# Altium schematic sheet 0200_GPP_MUX_G_H.SchDoc
size 848 x 558 mm
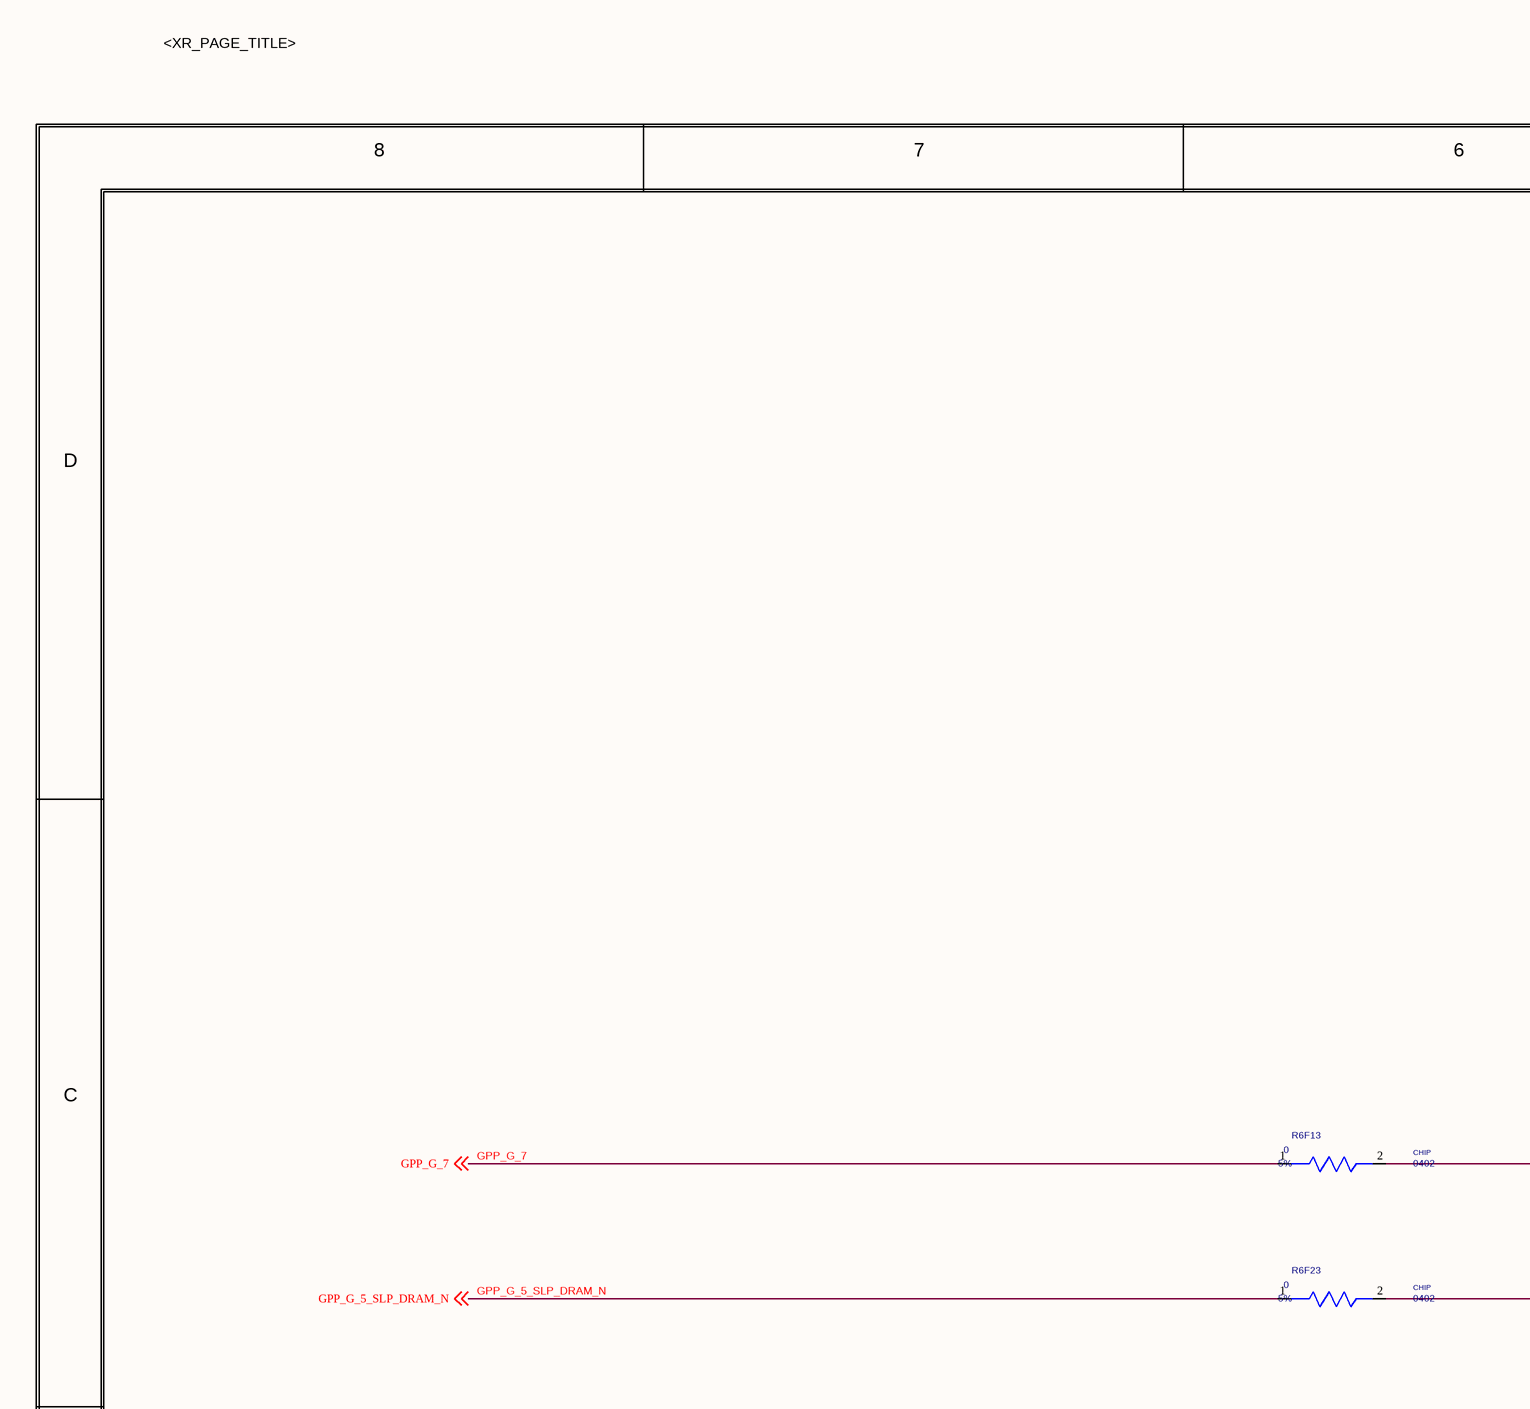
[diagram p0: 0200_GPP_MUX_G_H.SchDoc, top left]
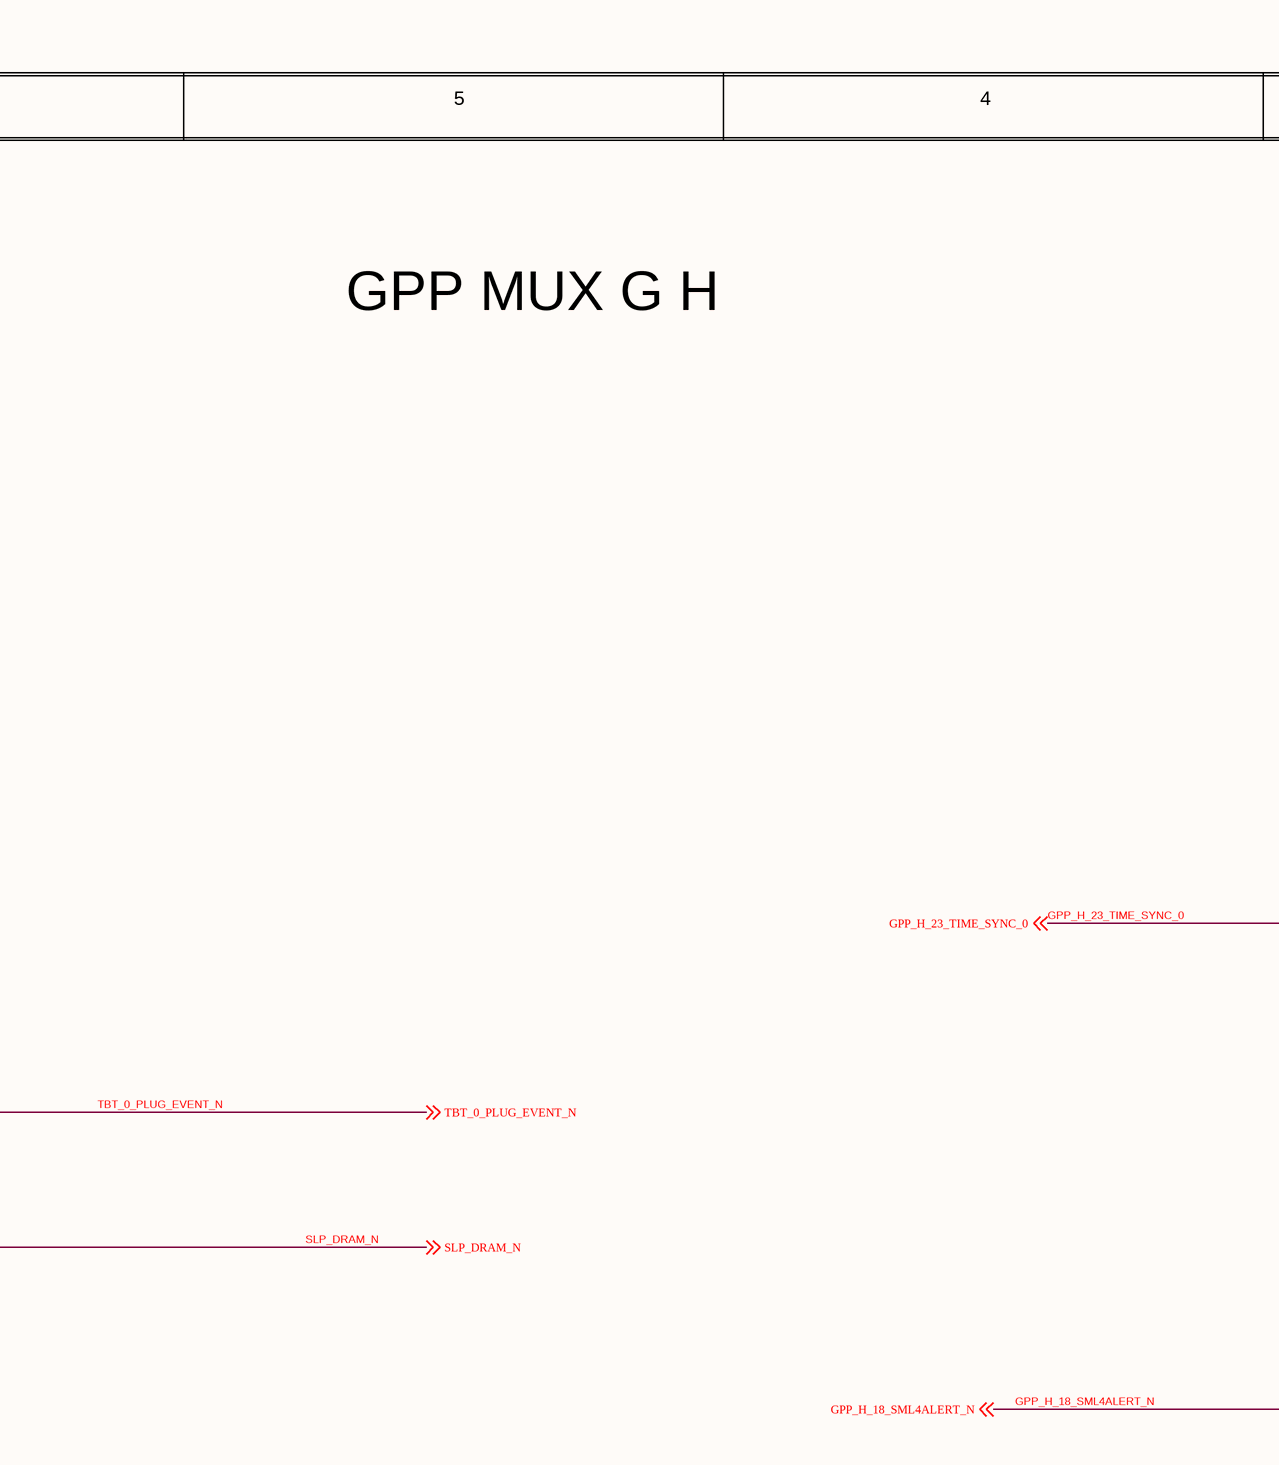
[diagram p1: 0200_GPP_MUX_G_H.SchDoc, top middle]
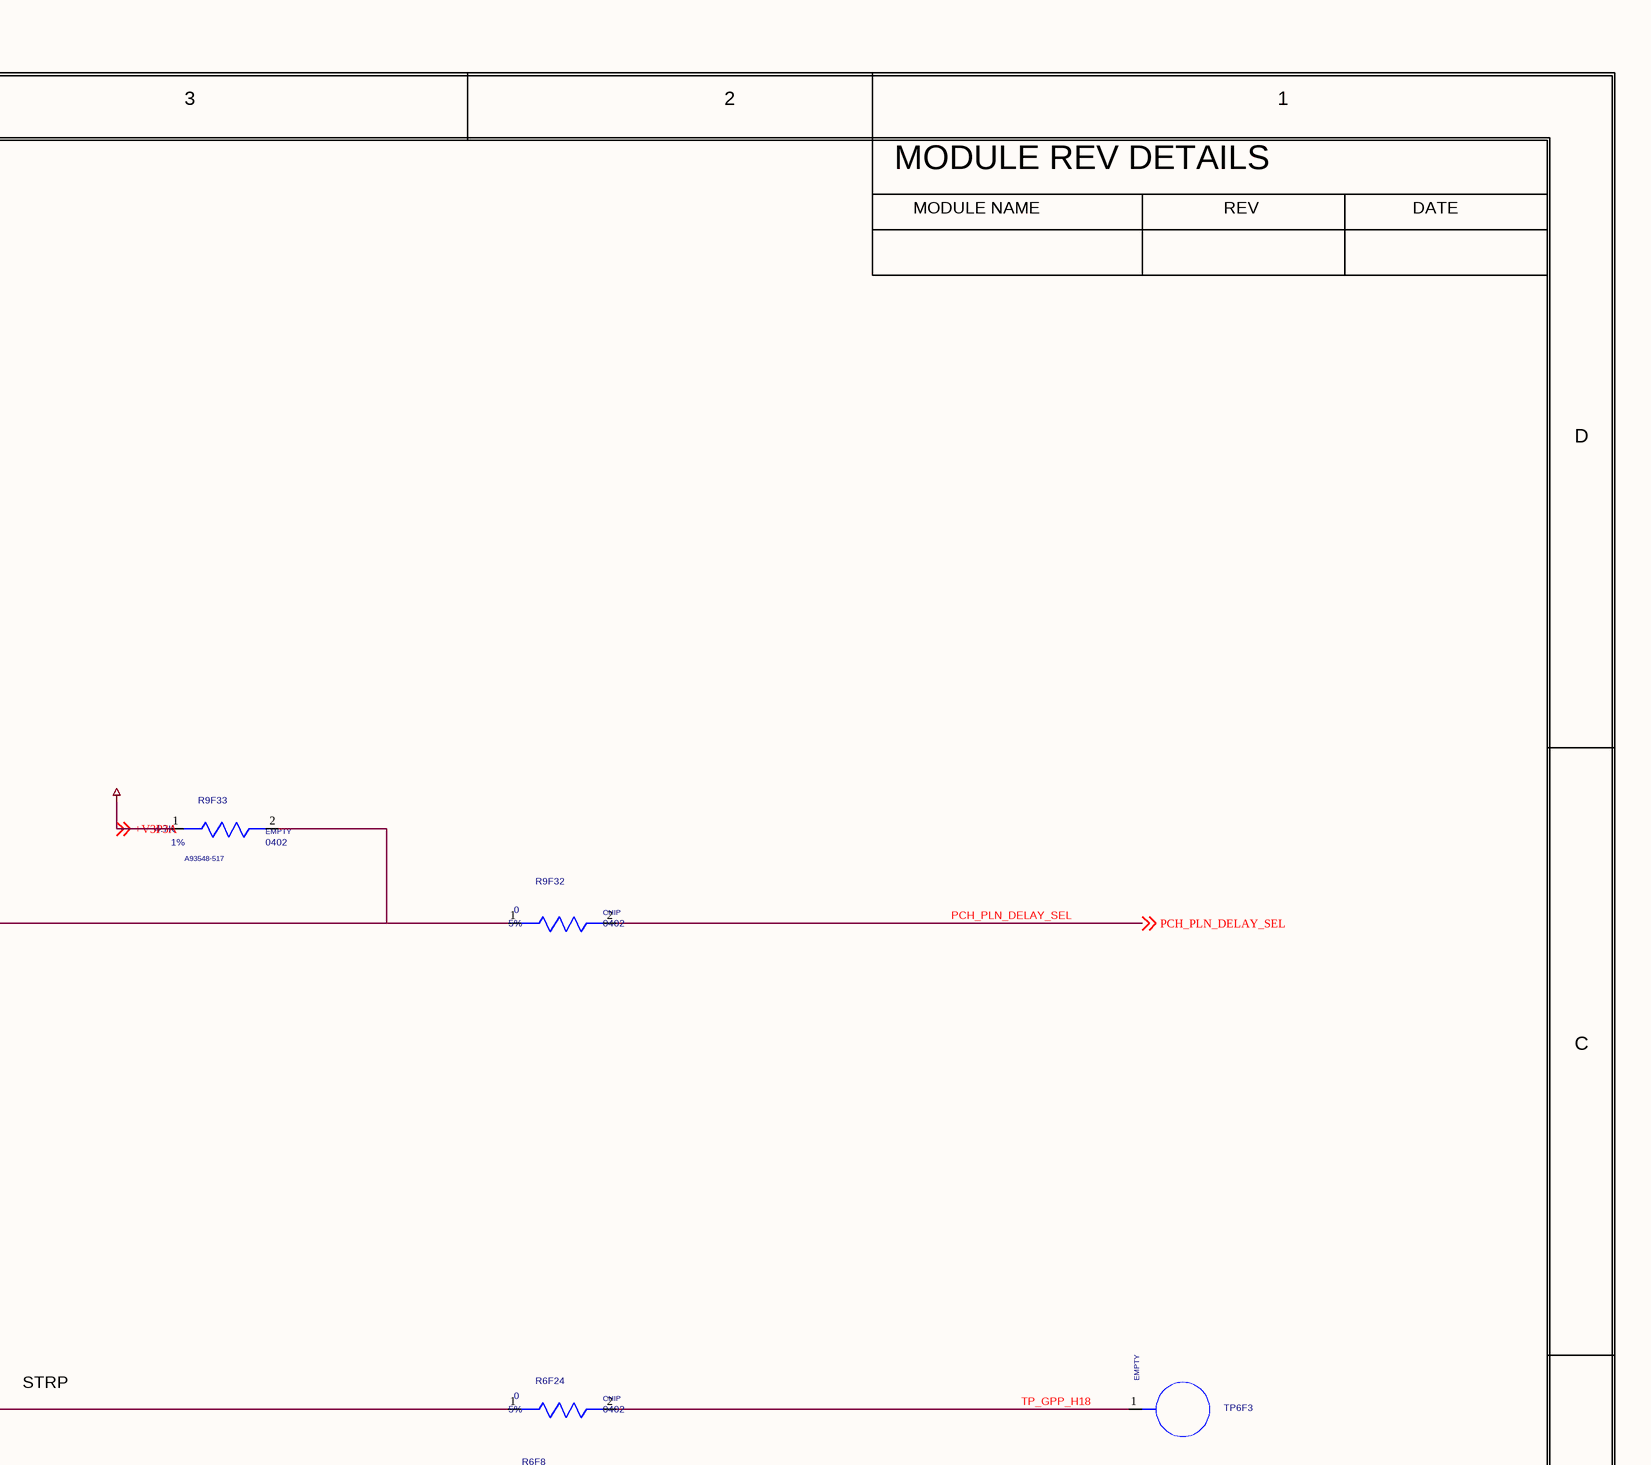
[diagram p2: 0200_GPP_MUX_G_H.SchDoc, top right]
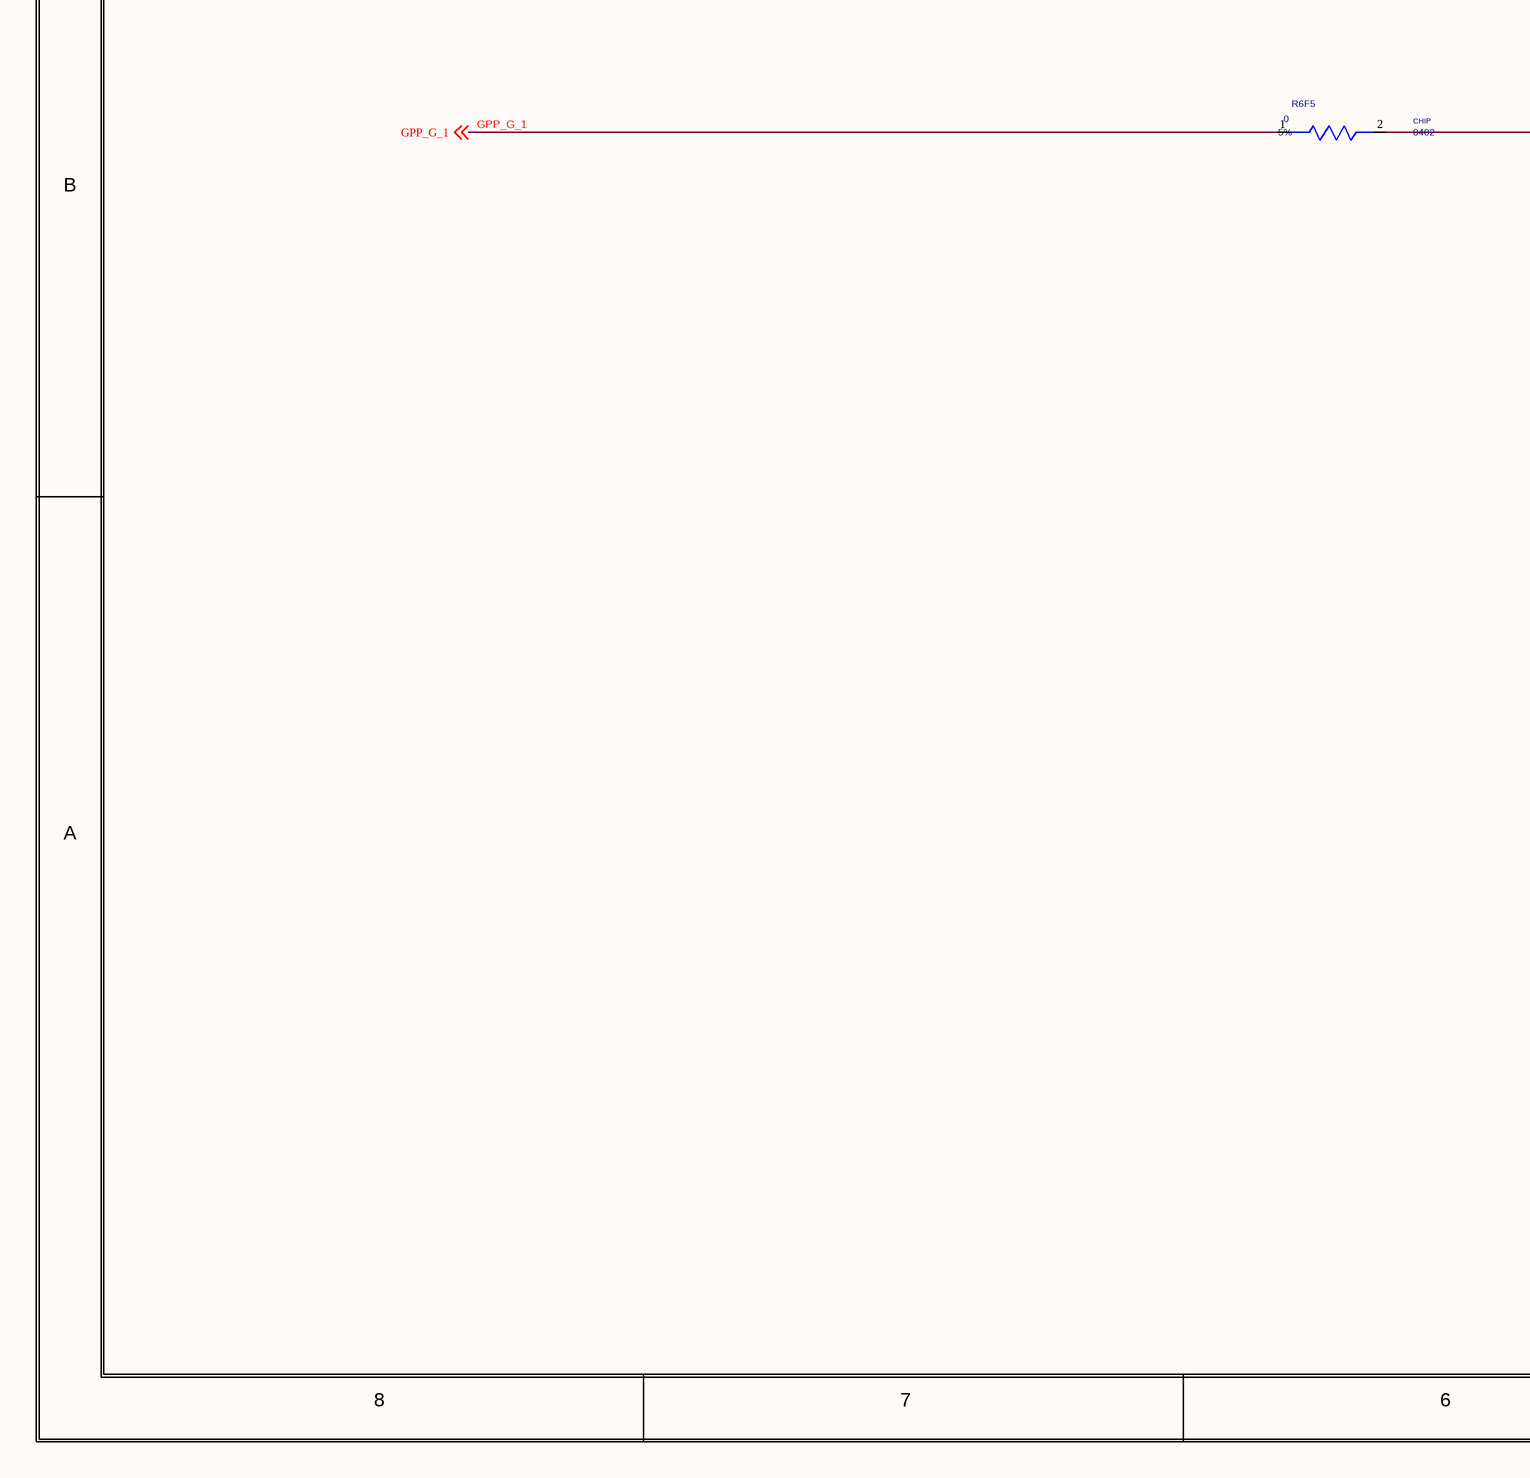
[diagram p3: 0200_GPP_MUX_G_H.SchDoc, bottom left]
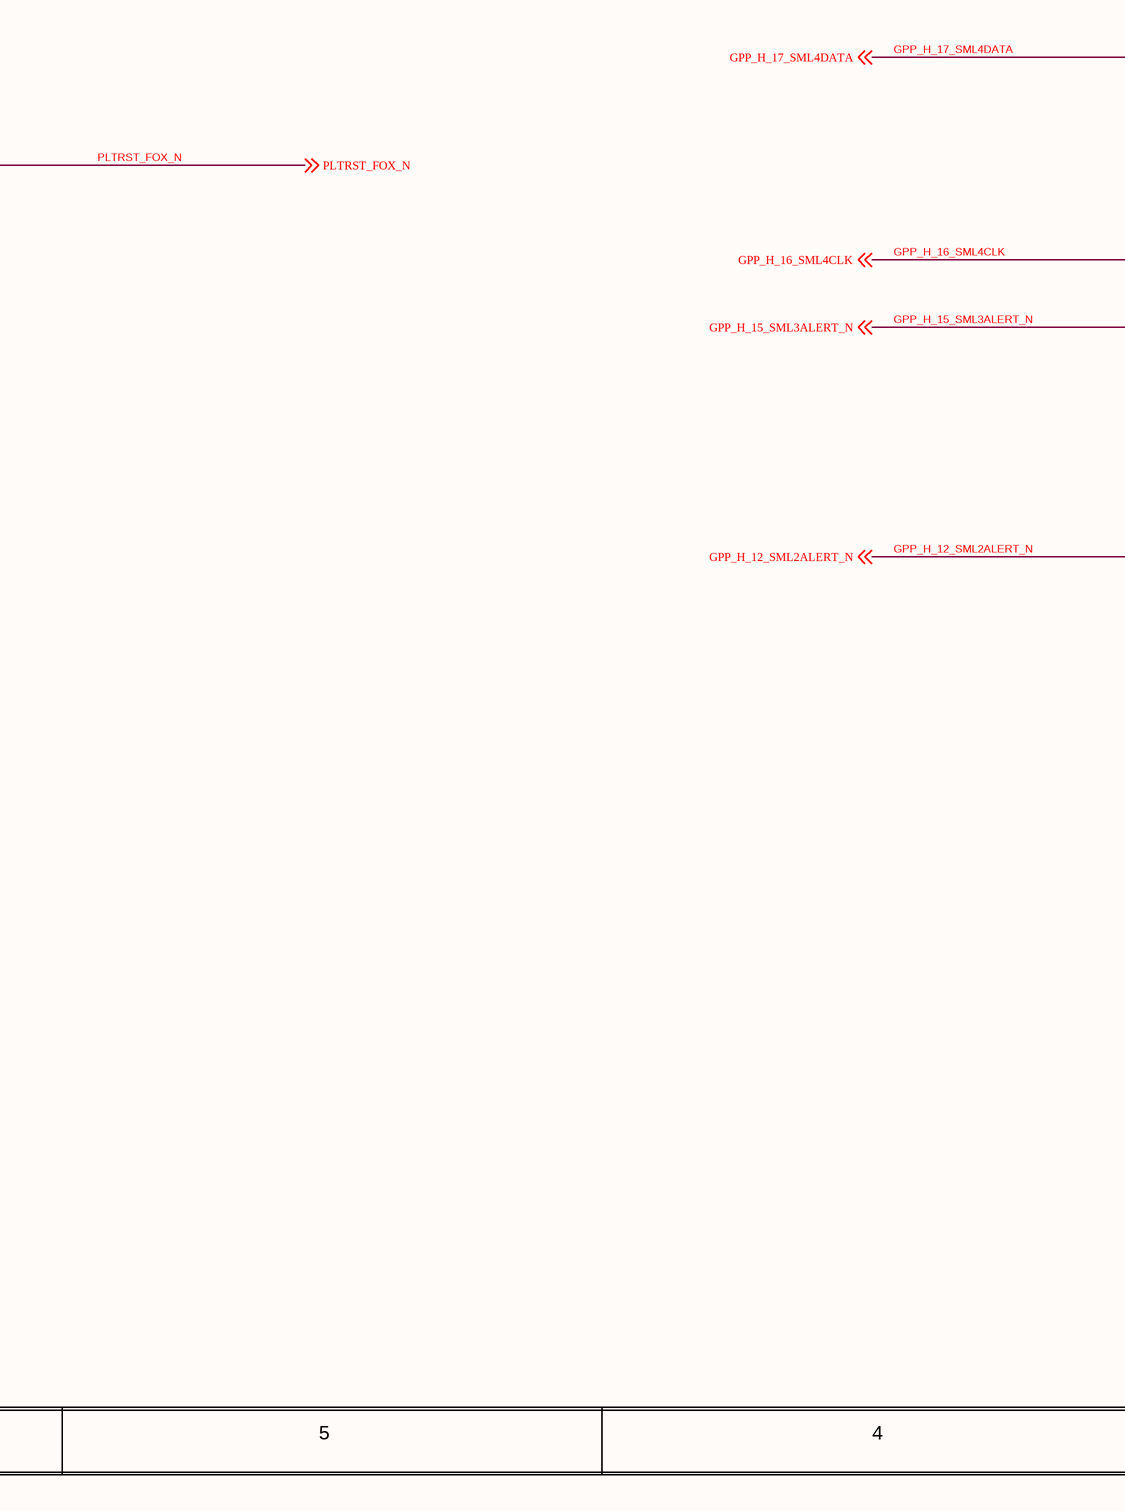
[diagram p4: 0200_GPP_MUX_G_H.SchDoc, bottom middle]
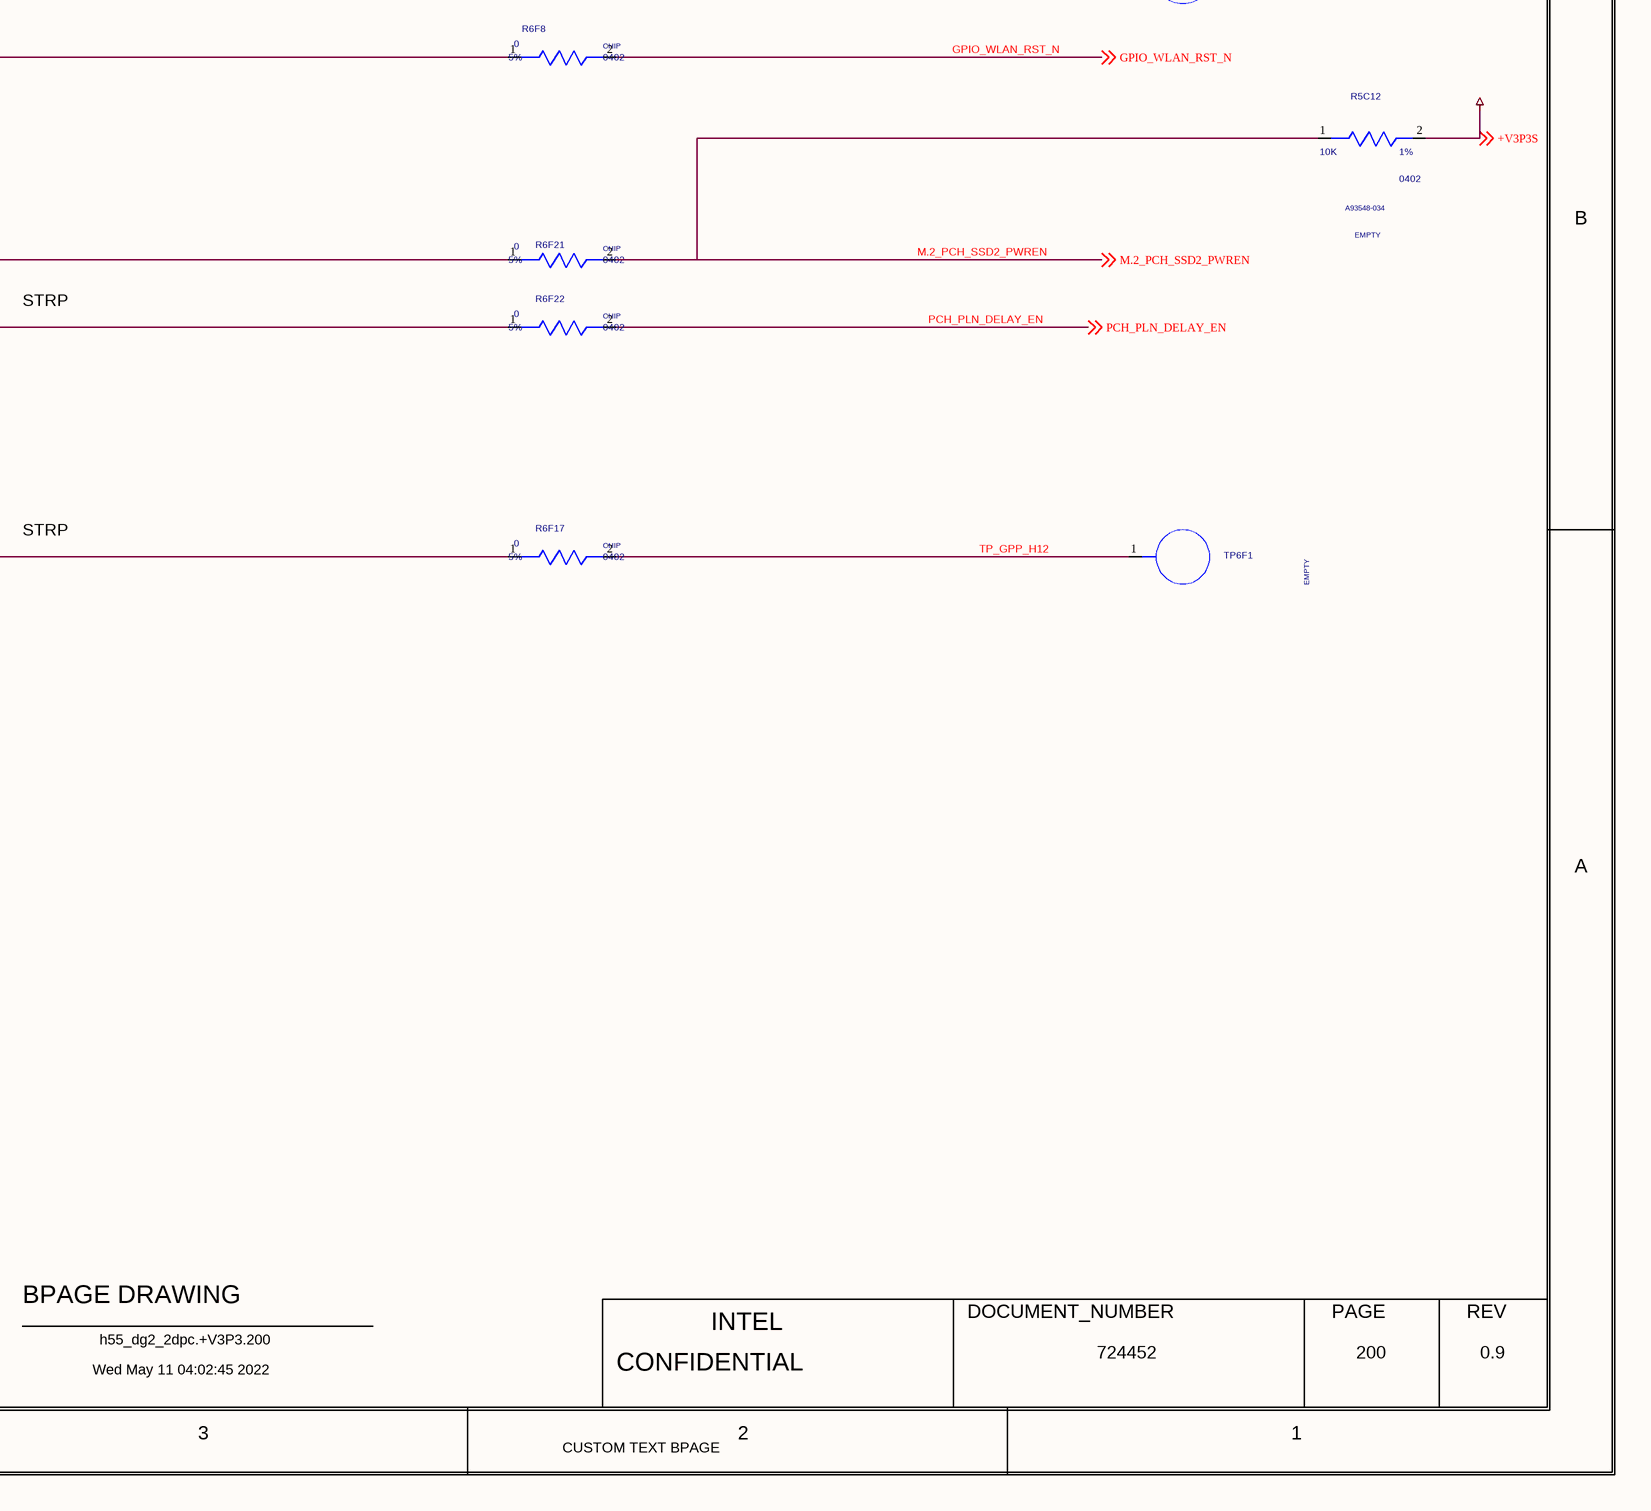
[diagram p5: 0200_GPP_MUX_G_H.SchDoc, bottom right]

## Parts
R5C12  10K  MATERIAL: EMPTY  PACK_TYPE: 0402  PART_NUMBER: A93548-034  TOLERANCE: 1%  [SMR0402IA]
R6F5  0  MATERIAL: CHIP  PACK_TYPE: 0402  TOLERANCE: 5%  [SMR0402IA]
R6F8  0  MATERIAL: CHIP  PACK_TYPE: 0402  TOLERANCE: 5%  [SMR0402IA]
R6F13  0  MATERIAL: CHIP  PACK_TYPE: 0402  TOLERANCE: 5%  [SMR0402IA]
R6F17  0  MATERIAL: CHIP  PACK_TYPE: 0402  TOLERANCE: 5%  [SMR0402IA]
R6F21  0  MATERIAL: CHIP  PACK_TYPE: 0402  TOLERANCE: 5%  [SMR0402IA]
R6F22  0  MATERIAL: CHIP  PACK_TYPE: 0402  TOLERANCE: 5%  [SMR0402IA]
R6F23  0  MATERIAL: CHIP  PACK_TYPE: 0402  TOLERANCE: 5%  [SMR0402IA]
R6F24  0  MATERIAL: CHIP  PACK_TYPE: 0402  TOLERANCE: 5%  [SMR0402IA]
R9F32  0  MATERIAL: CHIP  PACK_TYPE: 0402  TOLERANCE: 5%  [SMR0402IA]
R9F33  4.7K  MATERIAL: EMPTY  PACK_TYPE: 0402  PART_NUMBER: A93548-517  TOLERANCE: 1%  [SMR0402IA]
TP6F1  MATERIAL: EMPTY  [TPS16]  (hidden comment: TP20)
TP6F3  MATERIAL: EMPTY  [TPS16]  (hidden comment: TP20)

## Nets
+V3P3A: R9F33.1(A) ; off-sheet +V3P3A
+V3P3S: R5C12.2(B) ; off-sheet +V3P3S
GPIO_WLAN_RST_N: R6F8.2(B) ; off-sheet GPIO_WLAN_RST_N
GPP_G_1: R6F5.1(A) ; off-sheet GPP_G_1
GPP_G_5_SLP_DRAM_N: R6F23.1(A) ; off-sheet GPP_G_5_SLP_DRAM_N
GPP_G_7: R6F13.1(A) ; off-sheet GPP_G_7
GPP_H_12_SML2ALERT_N: R6F17.1(A) ; off-sheet GPP_H_12_SML2ALERT_N
GPP_H_15_SML3ALERT_N: R6F22.1(A) ; off-sheet GPP_H_15_SML3ALERT_N
GPP_H_16_SML4CLK: R6F21.1(A) ; off-sheet GPP_H_16_SML4CLK
GPP_H_17_SML4DATA: R6F8.1(A) ; off-sheet GPP_H_17_SML4DATA
GPP_H_18_SML4ALERT_N: R6F24.1(A) ; off-sheet GPP_H_18_SML4ALERT_N
GPP_H_23_TIME_SYNC_0: R9F32.1(A) R9F33.2(B) ; off-sheet GPP_H_23_TIME_SYNC_0
M.2_PCH_SSD2_PWREN: R5C12.1(A) R6F21.2(B) ; off-sheet M.2_PCH_SSD2_PWREN
PCH_PLN_DELAY_EN: R6F22.2(B) ; off-sheet PCH_PLN_DELAY_EN
PCH_PLN_DELAY_SEL: R9F32.2(B) ; off-sheet PCH_PLN_DELAY_SEL
PLTRST_FOX_N: R6F5.2(B) ; off-sheet PLTRST_FOX_N
SLP_DRAM_N: R6F23.2(B) ; off-sheet SLP_DRAM_N
TBT_0_PLUG_EVENT_N: R6F13.2(B) ; off-sheet TBT_0_PLUG_EVENT_N
TP_GPP_H12: R6F17.2(B) TP6F1.1(TP)
TP_GPP_H18: R6F24.2(B) TP6F3.1(TP)

## Notes on the sheet
- <XR_PAGE_TITLE>
- 8
- 7
- 6
- 5
- 4
- 3
- 2
- 1
- MODULE REV DETAILS
- MODULE NAME
- REV
- DATE
- GPP MUX G H
- D
- C
- STRP
- B
- A
- BPAGE DRAWING
- INTEL
- DOCUMENT_NUMBER
- PAGE
- Wed May 11 04:02:45 2022
- h55_dg2_2dpc.+V3P3.200
- CONFIDENTIAL
- 724452
- 200
- 0.9
- CUSTOM TEXT BPAGE

## Library data of the parts
R5C12 = RES#4: CHIPS_PART_NAME: RES; CDS_PHYS_PART_NAME: RES_0402-A93548-034,EMPTY,10K,1%,1/16W,LPDB,GENERIC; CDS_LMAN_SYM_OUTLINE: -50,25,50,-25; FP_TECH: LPDB; IP: GENERIC; WATTAGE: 1/16W; OriginalSymbolOrigin: (-75,25); XY: (-325,2350); VER: 10; ROT: 0; PHYS_PAGE: 200; LOCATION: R5C12; DRAWING: @RVP1_ADL_SB_ADP_S_DDR5_SODIMM_2DPC_LIB.H55_DG2_2DPC(SCH_1):PAGE569; CDS_LIB: discrete; PCB Footprint: SMR0402IA; SEC_TYPE: 0402; CDS_PART_NAME: RES_0402-A93548-034,EMPTY,10K,1%,1/16W,LPDB,GENERIC; CDS_LOCATION: R5C12; ASI_MODEL: A93548-034
R6F5 = RES#1: PART_NUMBER: A93549-001; CHIPS_PART_NAME: RES; CDS_PHYS_PART_NAME: RES_0402-A93549-001,CHIP,0,5%,1/16W,LPDB,GENERIC; WATTAGE: 1/16W; OriginalSymbolOrigin: (-75,25); XY: (-5725,2300); VER: 1; PHYS_PAGE: 200; LOCATION: R6F5; IP: GENERIC; FP_TECH: LPDB; DRAWING: @RVP1_ADL_SB_ADP_S_DDR5_SODIMM_2DPC_LIB.H55_DG2_2DPC(SCH_1):PAGE569; CDS_LIB: discrete; PCB Footprint: SMR0402IA; SEC_TYPE: 0402; ROT: 0; CDS_PART_NAME: RES_0402-A93549-001,CHIP,0,5%,1/16W,LPDB,GENERIC; CDS_LOCATION: R6F5; ASI_MODEL: A93549-001
R6F8 = RES#1: PART_NUMBER: A93549-001; CHIPS_PART_NAME: RES; CDS_PHYS_PART_NAME: RES_0402-A93549-001,CHIP,0,5%,1/16W,LPDB,GENERIC; WATTAGE: 1/16W; OriginalSymbolOrigin: (-75,25); XY: (-1825,2500); VER: 1; PHYS_PAGE: 200; LOCATION: R6F8; IP: GENERIC; FP_TECH: LPDB; DRAWING: @RVP1_ADL_SB_ADP_S_DDR5_SODIMM_2DPC_LIB.H55_DG2_2DPC(SCH_1):PAGE569; CDS_LIB: discrete; PCB Footprint: SMR0402IA; SEC_TYPE: 0402; ROT: 0; CDS_PART_NAME: RES_0402-A93549-001,CHIP,0,5%,1/16W,LPDB,GENERIC; CDS_LOCATION: R6F8; ASI_MODEL: A93549-001
R6F13 = RES#1: PART_NUMBER: A93549-001; CHIPS_PART_NAME: RES; CDS_PHYS_PART_NAME: RES_0402-A93549-001,CHIP,0,5%,1/16W,LPDB,GENERIC; WATTAGE: 1/16W; OriginalSymbolOrigin: (-75,25); XY: (-5725,3200); VER: 1; PHYS_PAGE: 200; LOCATION: R6F13; IP: GENERIC; FP_TECH: LPDB; DRAWING: @RVP1_ADL_SB_ADP_S_DDR5_SODIMM_2DPC_LIB.H55_DG2_2DPC(SCH_1):PAGE569; CDS_LIB: discrete; PCB Footprint: SMR0402IA; SEC_TYPE: 0402; ROT: 0; CDS_PART_NAME: RES_0402-A93549-001,CHIP,0,5%,1/16W,LPDB,GENERIC; CDS_LOCATION: R6F13; ASI_MODEL: A93549-001
R6F17 = RES#1: PART_NUMBER: A93549-001; CHIPS_PART_NAME: RES; CDS_PHYS_PART_NAME: RES_0402-A93549-001,CHIP,0,5%,1/16W,LPDB,GENERIC; WATTAGE: 1/16W; OriginalSymbolOrigin: (-75,25); XY: (-1825,1575); VER: 1; PHYS_PAGE: 200; LOCATION: R6F17; IP: GENERIC; FP_TECH: LPDB; DRAWING: @RVP1_ADL_SB_ADP_S_DDR5_SODIMM_2DPC_LIB.H55_DG2_2DPC(SCH_1):PAGE569; CDS_LIB: discrete; PCB Footprint: SMR0402IA; SEC_TYPE: 0402; ROT: 0; CDS_PART_NAME: RES_0402-A93549-001,CHIP,0,5%,1/16W,LPDB,GENERIC; CDS_LOCATION: R6F17; ASI_MODEL: A93549-001
R6F21 = RES#1: PART_NUMBER: A93549-001; CHIPS_PART_NAME: RES; CDS_PHYS_PART_NAME: RES_0402-A93549-001,CHIP,0,5%,1/16W,LPDB,GENERIC; WATTAGE: 1/16W; OriginalSymbolOrigin: (-75,25); XY: (-1825,2125); VER: 1; PHYS_PAGE: 200; LOCATION: R6F21; IP: GENERIC; FP_TECH: LPDB; DRAWING: @RVP1_ADL_SB_ADP_S_DDR5_SODIMM_2DPC_LIB.H55_DG2_2DPC(SCH_1):PAGE569; CDS_LIB: discrete; PCB Footprint: SMR0402IA; SEC_TYPE: 0402; ROT: 0; CDS_PART_NAME: RES_0402-A93549-001,CHIP,0,5%,1/16W,LPDB,GENERIC; CDS_LOCATION: R6F21; ASI_MODEL: A93549-001
R6F22 = RES#1: PART_NUMBER: A93549-001; CHIPS_PART_NAME: RES; CDS_PHYS_PART_NAME: RES_0402-A93549-001,CHIP,0,5%,1/16W,LPDB,GENERIC; WATTAGE: 1/16W; OriginalSymbolOrigin: (-75,25); XY: (-1825,2000); VER: 1; PHYS_PAGE: 200; LOCATION: R6F22; IP: GENERIC; FP_TECH: LPDB; DRAWING: @RVP1_ADL_SB_ADP_S_DDR5_SODIMM_2DPC_LIB.H55_DG2_2DPC(SCH_1):PAGE569; CDS_LIB: discrete; PCB Footprint: SMR0402IA; ROT: 0; CDS_PART_NAME: RES_0402-A93549-001,CHIP,0,5%,1/16W,LPDB,GENERIC; CDS_LOCATION: R6F22; ASI_MODEL: A93549-001
R6F23 = RES#1: PART_NUMBER: A93549-001; CHIPS_PART_NAME: RES; CDS_PHYS_PART_NAME: RES_0402-A93549-001,CHIP,0,5%,1/16W,LPDB,GENERIC; WATTAGE: 1/16W; OriginalSymbolOrigin: (-75,25); XY: (-5725,2950); VER: 1; PHYS_PAGE: 200; LOCATION: R6F23; IP: GENERIC; FP_TECH: LPDB; DRAWING: @RVP1_ADL_SB_ADP_S_DDR5_SODIMM_2DPC_LIB.H55_DG2_2DPC(SCH_1):PAGE569; CDS_LIB: discrete; PCB Footprint: SMR0402IA; SEC_TYPE: 0402; ROT: 0; CDS_PART_NAME: RES_0402-A93549-001,CHIP,0,5%,1/16W,LPDB,GENERIC; CDS_LOCATION: R6F23; ASI_MODEL: A93549-001
R6F24 = RES#1: PART_NUMBER: A93549-001; CHIPS_PART_NAME: RES; CDS_PHYS_PART_NAME: RES_0402-A93549-001,CHIP,0,5%,1/16W,LPDB,GENERIC; WATTAGE: 1/16W; OriginalSymbolOrigin: (-75,25); XY: (-1825,2650); VER: 1; PHYS_PAGE: 200; LOCATION: R6F24; IP: GENERIC; FP_TECH: LPDB; DRAWING: @RVP1_ADL_SB_ADP_S_DDR5_SODIMM_2DPC_LIB.H55_DG2_2DPC(SCH_1):PAGE569; CDS_LIB: discrete; PCB Footprint: SMR0402IA; SEC_TYPE: 0402; ROT: 0; CDS_PART_NAME: RES_0402-A93549-001,CHIP,0,5%,1/16W,LPDB,GENERIC; CDS_LOCATION: R6F24; ASI_MODEL: A93549-001
R9F32 = RES#1: PART_NUMBER: A93549-001; CHIPS_PART_NAME: RES; CDS_PHYS_PART_NAME: RES_0402-A93549-001,CHIP,0,5%,1/16W,LPDB,GENERIC; WATTAGE: 1/16W; OriginalSymbolOrigin: (-75,25); XY: (-1825,3550); VER: 1; PHYS_PAGE: 200; LOCATION: R9F32; IP: GENERIC; FP_TECH: LPDB; DRAWING: @RVP1_ADL_SB_ADP_S_DDR5_SODIMM_2DPC_LIB.H55_DG2_2DPC(SCH_1):PAGE569; CDS_LIB: discrete; PCB Footprint: SMR0402IA; SEC_TYPE: 0402; ROT: 0; CDS_PART_NAME: RES_0402-A93549-001,CHIP,0,5%,1/16W,LPDB,GENERIC; CDS_LOCATION: R9F32; ASI_MODEL: A93549-001
R9F33 = RES#1: CHIPS_PART_NAME: RES; CDS_PHYS_PART_NAME: RES_0402-A93548-517,EMPTY,4.7K,1%,1/16W,LPDB,GENERIC; WATTAGE: 1/16W; OriginalSymbolOrigin: (-75,25); XY: (-2450,3725); VER: 1; ROT: 0; PHYS_PAGE: 200; LOCATION: R9F33; IP: GENERIC; FP_TECH: LPDB; DRAWING: @RVP1_ADL_SB_ADP_S_DDR5_SODIMM_2DPC_LIB.H55_DG2_2DPC(SCH_1):PAGE569; CDS_LIB: discrete; PCB Footprint: SMR0402IA; CDS_PART_NAME: RES_0402-A93548-517,EMPTY,4.7K,1%,1/16W,LPDB,GENERIC; CDS_LOCATION: R9F33; ASI_MODEL: A93548-517
TP6F1 = TP#1: PART_NUMBER: NA_TPS16; CHIPS_PART_NAME: TP; CDS_PHYS_PART_NAME: TP_SM-NA_TPS16,EMPTY,TPS16,LPDB,GENERIC; CDS_LMAN_SYM_OUTLINE: -50,50,50,-50; PACK_TYPE: SM; OriginalSymbolOrigin: (-50,75); XY: (-675,1575); VER: 3; ROT: 1; PHYS_PAGE: 200; LOCATION: TP6F1; IP: GENERIC; FP_TECH: LPDB; DRAWING: @RVP1_ADL_SB_ADP_S_DDR5_SODIMM_2DPC_LIB.H55_DG2_2DPC(SCH_1):PAGE569; CDS_LIB: board_artifacts; PCB Footprint: TPS16; CDS_PART_NAME: TP_SM-NA_TPS16,EMPTY,TPS16,LPDB,GENERIC; CDS_LOCATION: TP6F1; ASI_MODEL: NA_TPS16
TP6F3 = TP#1: PART_NUMBER: NA_TPS16; CHIPS_PART_NAME: TP; CDS_PHYS_PART_NAME: TP_SM-NA_TPS16,EMPTY,TPS16,LPDB,GENERIC; CDS_LMAN_SYM_OUTLINE: -50,50,50,-50; PACK_TYPE: SM; OriginalSymbolOrigin: (-50,75); XY: (-675,2650); VER: 3; ROT: 1; PHYS_PAGE: 200; LOCATION: TP6F3; IP: GENERIC; FP_TECH: LPDB; DRAWING: @RVP1_ADL_SB_ADP_S_DDR5_SODIMM_2DPC_LIB.H55_DG2_2DPC(SCH_1):PAGE569; CDS_LIB: board_artifacts; PCB Footprint: TPS16; CDS_PART_NAME: TP_SM-NA_TPS16,EMPTY,TPS16,LPDB,GENERIC; CDS_LOCATION: TP6F3; ASI_MODEL: NA_TPS16